# EAGLE design MYO_ESPControlBoard_Rev_1 (EAGLE 7.6.0)
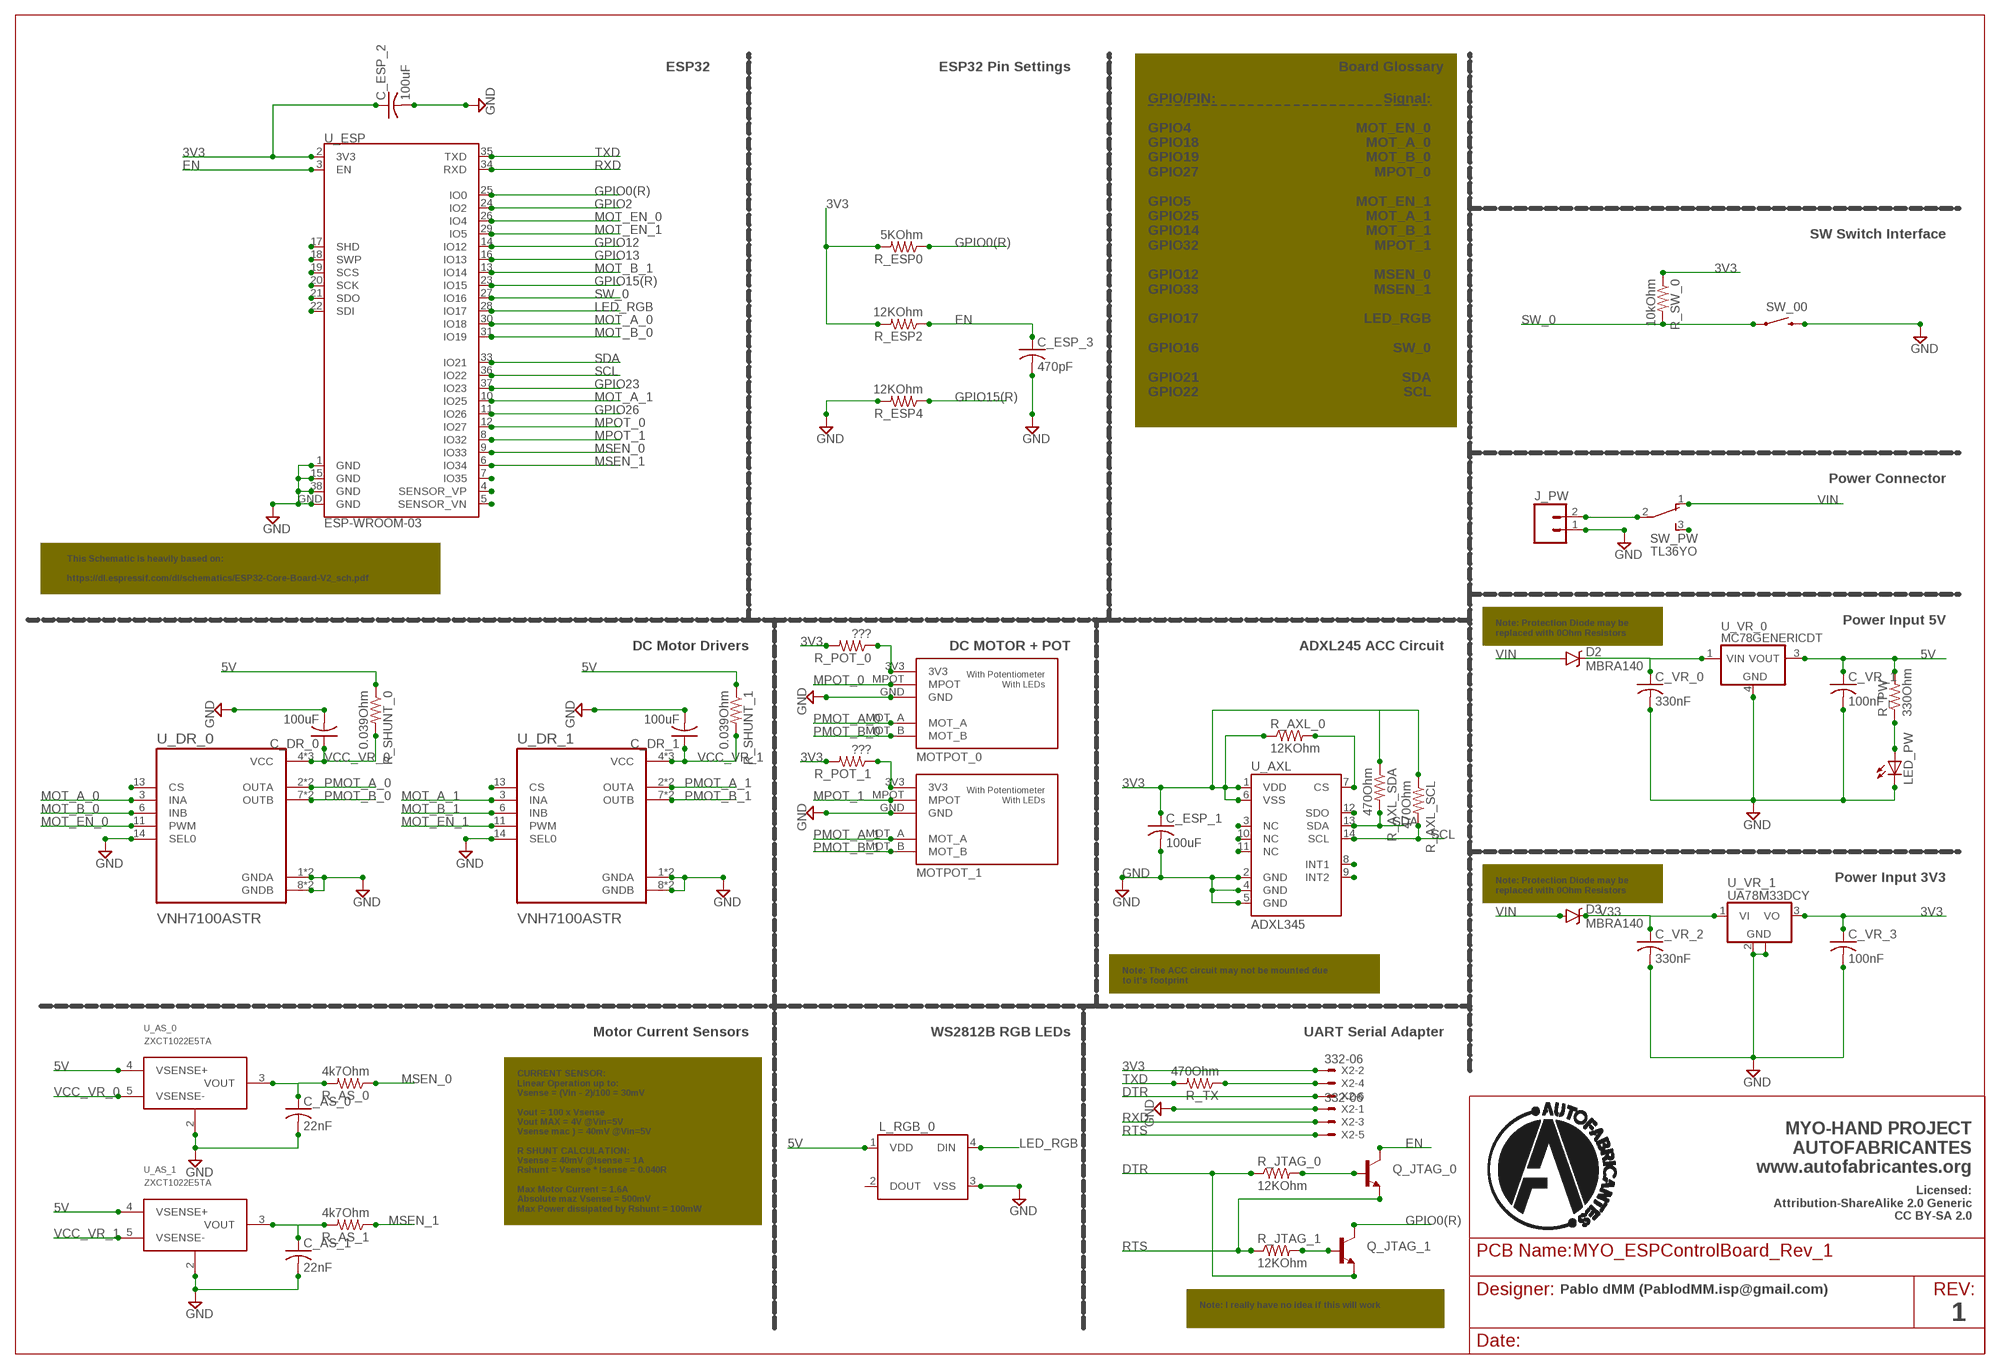
[diagram p0: schematic, sheet 1]

## Parts
C_AS_0  22nF  C-USC0805K  [C0805K]
C_AS_1  22nF  C-USC0805K  [C0805K]
C_DR_0  100uF  C-USC0805K  [C0805K]
C_DR_1  100uF  C-USC0805K  [C0805K]
C_ESP_1  100uF  C-USC0805K  [C0805K]
C_ESP_2  100uF  C-USC0805K  [C0805K]
C_ESP_3  470pF  C-USC0805K  [C0805K]
C_VR_0  330nF  C-USC0805  [C0805]
C_VR_1  100nF  C-USC0805  [C0805]
C_VR_2  330nF  C-USC0805  [C0805]
C_VR_3  100nF  C-USC0805  [C0805]
D2  MBRA140  [SMA-DIODE]
D3  MBRA140  [SMA-DIODE]
J_PW  M02-JST-2MM-SMT  [JST-2-SMD]
L_RGB_0  WS2812B  [WS2812B]
LED_PW  LEDSMT1206  [1206]
MOTPOT_0  POLOLU_MOT_POT  [POLOLU_MOT_POT]
MOTPOT_1  POLOLU_MOT_POT  [POLOLU_MOT_POT]
Q_JTAG_0  TRANSISTOR_NPNSOT23-3  [SOT23-3]
Q_JTAG_1  TRANSISTOR_NPNSOT23-3  [SOT23-3]
R_AS_0  4k7Ohm  R-US_M0805  [M0805]
R_AS_1  4k7Ohm  R-US_M0805  [M0805]
R_AXL_0  12KOhm  R-US_M0805  [M0805]
R_AXL_SCL  470Ohm  R-US_M0805  [M0805]
R_AXL_SDA  470Ohm  R-US_M0805  [M0805]
R_ESP0  5KOhm  R-US_M0805  [M0805]
R_ESP2  12KOhm  R-US_M0805  [M0805]
R_ESP4  12KOhm  R-US_M0805  [M0805]
R_JTAG_0  12KOhm  R-US_M0805  [M0805]
R_JTAG_1  12KOhm  R-US_M0805  [M0805]
R_POT_0  ???  R-US_M0805  [M0805]
R_POT_1  ???  R-US_M0805  [M0805]
R_PW  330Ohm  R-US_M0805  [M0805]
R_SHUNT_0  0.039Ohm  R-US_M0805  [M0805]
R_SHUNT_1  0.039Ohm  R-US_M0805  [M0805]
R_SW_0  10kOhm  R-US_M0805  [M0805]
R_TX  470Ohm  R-US_M0805  [M0805]
SW_00  SWITCH-MOMENTARY-2TACTILE-SWITCH-SMD-RIGHT-ANGLE  [TACTILE_SWITCH-SMD-RIGHT-ANGLE]
SW_PW  TL36YO  [TL3XYO]
U_AS_0  ZXCT1022E5TA  [SOT95P270X145-5N(SOT23-5)]
U_AS_1  ZXCT1022E5TA  [SOT95P270X145-5N(SOT23-5)]
U_AXL  ADXL345  [LGA14]
U_DR_0  VNH7100ASTR  [SOIC127P600X175-16N]
U_DR_1  VNH7100ASTR  [SOIC127P600X175-16N]
U_ESP  ESP-WROOM-03  [ESP-WROOM-03]
U_VR_0  MC78GENERICDT  [DPAK-3]
U_VR_1  UA78M33DCY  [SOT223]
X2  332-06  [332-06]

## Nets
3V3: C_ESP_1.1 C_ESP_2.1 C_VR_3.1 R_AXL_0.1 R_AXL_SCL.1 R_AXL_SDA.1 R_ESP0.2 R_ESP2.2 R_POT_0.2 R_POT_1.2 R_SW_0.1 U_AXL.1(VDD) U_AXL.6(VSS) U_ESP.2(3V3) U_VR_1.3(VO) X2.2
5V [GND]: C_VR_1.1 L_RGB_0.1(VDD) R_PW.2 R_SHUNT_0.1 R_SHUNT_1.1 U_AS_0.4(VSENSE+) U_AS_1.4(VSENSE+) U_VR_0.3(VOUT)
DTR: Q_JTAG_1.2(E) R_JTAG_0.1 X2.6
EN: C_ESP_3.1 Q_JTAG_0.3(C) R_ESP2.1 U_ESP.3(EN)
GND [GND]: C_AS_0.2 C_AS_1.2 C_DR_0.2 C_DR_1.2 C_ESP_1.2 C_ESP_2.2 C_ESP_3.2 C_VR_0.2 C_VR_1.2 C_VR_2.2 C_VR_3.2 J_PW.1 L_RGB_0.3(VSS) LED_PW.C MOTPOT_0.GND MOTPOT_1.GND R_ESP4.2 SW_00.2 U_AS_0.2(GND) U_AS_1.2(GND) U_AXL.2(GND) U_AXL.4(GND) U_AXL.5(GND) U_DR_0.1(GNDA) U_DR_0.8(GNDB) U_DR_0.9(GNDB) U_DR_0.14(SEL0) U_DR_0.16(GNDA) U_DR_1.1(GNDA) U_DR_1.8(GNDB) U_DR_1.9(GNDB) U_DR_1.14(SEL0) U_DR_1.16(GNDA) U_ESP.1(GND) U_ESP.15(GND) U_ESP.38(GND) U_ESP.GND U_VR_0.4(GND) U_VR_1.2(GND) U_VR_1.4(GND) X2.1
GPIO0(R): Q_JTAG_1.3(C) R_ESP0.1 U_ESP.25(IO0)
GPIO2: U_ESP.24(IO2)
GPIO12: U_ESP.14(IO12)
GPIO13: U_ESP.16(IO13)
GPIO15(R): R_ESP4.1 U_ESP.23(IO15)
GPIO23: U_ESP.37(IO23)
GPIO26: U_ESP.11(IO26)
LED_RGB: L_RGB_0.4(DIN) U_ESP.28(IO17)
MOT_A_0: U_DR_0.3(INA) U_ESP.30(IO18)
MOT_A_1: U_DR_1.3(INA) U_ESP.10(IO25)
MOT_B_0: U_DR_0.6(INB) U_ESP.31(IO19)
MOT_B_1: U_DR_1.6(INB) U_ESP.13(IO14)
MOT_EN_0: U_DR_0.11(PWM) U_ESP.26(IO4)
MOT_EN_1: U_DR_1.11(PWM) U_ESP.29(IO5)
MPOT_0: MOTPOT_0.MPOT U_ESP.12(IO27)
MPOT_1: MOTPOT_1.MPOT U_ESP.8(IO32)
MSEN_0: R_AS_0.1 U_ESP.9(IO33)
MSEN_1: R_AS_1.1 U_ESP.6(IO34)
N$1: U_DR_0.13(CS)
N$2: MOTPOT_0.3V3 R_POT_0.1
N$3: MOTPOT_1.3V3 R_POT_1.1
N$4: Q_JTAG_0.1(B) R_JTAG_0.2
N$5: LED_PW.A R_PW.1
N$6: U_DR_1.13(CS)
N$7: Q_JTAG_1.1(B) R_JTAG_1.2
N$9: R_TX.1 X2.4
N$11: C_AS_0.1 R_AS_0.2 U_AS_0.3(VOUT)
N$16: U_ESP.17(SHD)
N$17: U_AXL.11(NC)
N$20: U_ESP.18(SWP)
N$21: U_AXL.10(NC)
N$22: R_AXL_0.2 U_AXL.7(CS)
N$23: U_AXL.3(NC)
N$24: U_AXL.12(SDO)
N$25: U_AXL.8(INT1)
N$26: U_AXL.9(INT2)
N$27: U_ESP.19(SCS)
N$28: U_ESP.20(SCK)
N$29: U_ESP.21(SDO)
N$30: U_ESP.22(SDI)
N$31: J_PW.2 SW_PW.2(P)
N$33: U_ESP.7(IO35)
N$34: U_ESP.5(SENSOR_VN)
N$35: U_ESP.4(SENSOR_VP)
N$36: SW_PW.3(S)
N$42: C_AS_1.1 R_AS_1.2 U_AS_1.3(VOUT)
PMOT_A_0: MOTPOT_0.MOT_A U_DR_0.2(OUTA) U_DR_0.15(OUTA)
PMOT_A_1: MOTPOT_1.MOT_A U_DR_1.2(OUTA) U_DR_1.15(OUTA)
PMOT_B_0: MOTPOT_0.MOT_B U_DR_0.7(OUTB) U_DR_0.10(OUTB)
PMOT_B_1: MOTPOT_1.MOT_B U_DR_1.7(OUTB) U_DR_1.10(OUTB)
RTS: Q_JTAG_0.2(E) R_JTAG_1.1 X2.5
RXD: U_ESP.34(RXD) X2.3
SCL: R_AXL_SCL.2 U_AXL.14(SCL) U_ESP.36(IO22)
SDA: R_AXL_SDA.2 U_AXL.13(SDA) U_ESP.33(IO21)
SW_0: R_SW_0.2 SW_00.1 U_ESP.27(IO16)
TXD: R_TX.2 U_ESP.35(TXD)
V5: C_VR_0.1 D2.C U_VR_0.1(VIN)
V33: C_VR_2.1 D3.C U_VR_1.1(VI)
VCC_VR_0 [GND]: C_DR_0.1 R_SHUNT_0.2 U_AS_0.5(VSENSE-) U_DR_0.4(VCC) U_DR_0.5(VCC) U_DR_0.12(VCC)
VCC_VR_1 [GND]: C_DR_1.1 R_SHUNT_1.2 U_AS_1.5(VSENSE-) U_DR_1.4(VCC) U_DR_1.5(VCC) U_DR_1.12(VCC)
VIN: D2.A D3.A SW_PW.1(O)
Unconnected: L_RGB_0.2(DOUT)

## Notes on the sheet
- ESP32 | ESP32 Pin Settings | Board Glossary
- SW Switch Interface
- GPIO/PIN:
  
  GPIO4
  GPIO18
  GPIO19
  GPIO27
  
  GPIO5
  GPIO25
  GPIO14
  GPIO32
  
  GPIO12
  GPIO33
  
  GPIO17
  
  GPIO16
  
  GPIO21
  GPIO22
- Signal:
  
  MOT_EN_0
  MOT_A_0
  MOT_B_0
  MPOT_0
  
  MOT_EN_1
  MOT_A_1
  MOT_B_1
  MPOT_1
  
  MSEN_0
  MSEN_1
  
  LED_RGB
  
  SW_0
  
  SDA
  SCL
- Power Connector
- This Schematic is heavily based on:
  
  https://dl.espressif.com/dl/schematics/ESP32-Core-Board-V2_sch.pdf
- Note: Protection Diode may be
  replaced with 0Ohm Resistors
- Power Input 5V
- DC Motor Drivers | DC MOTOR + POT | ADXL245 ACC Circuit
- Note: Protection Diode may be
  replaced with 0Ohm Resistors
- Power Input 3V3
- Note: The ACC circuit may not be mounted due
  to it's footprint
- Motor Current Sensors | WS2812B RGB LEDs | UART Serial Adapter
- CURRENT SENSOR:
  Linear Operation up to:
  Vsense = (Vin - 2)/100 = 30mV
  
  Vout = 100 x Vsense
  Vout MAX = 4V @Vin=5V
  Vsense mac ) = 40mV @Vin=5V
  
  R SHUNT CALCULATION:
  Vsense = 40mV @Isense = 1A
  Rshunt = Vsense * Isense = 0.040R
  
  Max Motor Current = 1.6A
  Absolute maz Vsense = 500mV
  Max Power dissipated by Rshunt = 100mW
- MYO-HAND PROJECT
  AUTOFABRICANTES
  www.autofabricantes.org
- Licensed:
  Attribution-ShareAlike 2.0 Generic
  CC BY-SA 2.0
- Pablo dMM (PablodMM.isp@gmail.com)
- Note: I really have no idea if this will work | 1

## Library data of the parts
C_AS_0 C_AS_1 C_DR_0 C_DR_1 C_ESP_1-C_ESP_3 C_VR_0 C_VR_1-C_VR_3 = adafruit:C-US: CAPACITOR, American symbol
D2 D3 = SparkFun-DiscreteSemi:MBRA140: 40V, 1A Schottky rectifier SMA/DO-214AC package DIO-08053; PROD_ID: DIO-08053
J_PW = SparkFun:M02: Header 2 Standard 2-pin 0.1" header. Use with straight break away headers (SKU : PRT-00116), right angle break away headers (PRT-00553), swiss pins (PRT-00743), machine pins (PRT-00117), and female headers (PRT-00115). Molex polarized connector foot print use with SKU : PRT-08233 with associated crimp pins and housings.
L_RGB_0 = SparkFun-LED:WS2812B: WS2812B - Intelligent control LED integrated light source Technical Specifications: Power Supply Voltage (VDD): 3.5 to 5.3 V Input Voltage (VI): -0.5 to VDD+0.5 V Operating Junction Temperature (Topt): -25°C to +80°C Storage Temperature Range (Tstg): -55°C to +150°C; PROD_ID: DIO-12503
LED_PW = adafruit:LED: LED OSRAM: - CHIPLED LG R971, LG N971, LY N971, LG Q971, LY Q971, LO R971, LY R971 LH N974, LH R974 LS Q976, LO Q976, LY Q976 LO Q996 - Hyper CHIPLED LW Q18S LB Q993, LB Q99A, LB R99A - SideLED LS A670, LO A670, LY A670, LG A670, LP A670 LB A673, LV A673, LT A673, LW A673 LH A674 LY A675 LS A676, LA A676, LO A676, LY A676, LW A676 LS A679, LY A679, LG A679 - Hyper Micro SIDELED® LS Y876, LA Y876, LO Y876, LY Y876 LT Y87S - SmartLED LW L88C, LW L88S LB L89C, LB L89S, LG L890 LS L89K, LO L89K, LY L89K LS L896, LA L896, LO L896, LY L896 - TOPLED LS T670, LO T670, LY T670, LG T670, LP T670 LSG T670, LSP T670, LSY T670, LOP T670, LYG T670 LG T671, LOG T671, LSG T671 LB T673, LV T673, LT T673, LW T673 LH T674 LS T676, LA T676, LO T676, LY T676, LB T676, LH T676, LSB T676, LW T676 LB T67C, LV T67C, LT T67C, LS T67K, LO T67K, LY T67K, LW E67C LS E67B, LA E67B, LO E67B, LY E67B, LB E67C, LV E67C, LT E67C LW T67C LS T679, LY T679, LG T679 LS T770, LO T770, LY T770, LG T770, LP T770 LB T773, LV T773, LT T773, LW T773 LH T774 LS E675, LA E675, LY E675, LS T675 LS T776, LA T776, LO T776, LY T776, LB T776 LHGB T686 LT T68C, LB T68C - Hyper Mini TOPLED® LB M676 - Mini TOPLED Santana® LG M470 LS M47K, LO M47K, LY M47K Source: http://www.osram.convergy.de/
MOTPOT_0 MOTPOT_1 = PololuMotors:POLOLU_MOT_POT: Pololu Small Gearmotor with mechanical attach. With LEDs
Q_JTAG_0 Q_JTAG_1 = SparkFun:TRANSISTOR_NPN: Transistor NPN BJT configuration in SOT23 package. MMBT2222 is the common NPN we use. Double check BCE configuration again layout.
R_AS_0 R_AS_1 R_AXL_0 R_AXL_SCL R_AXL_SDA R_ESP0 R_ESP2 R_ESP4 R_JTAG_0 R_JTAG_1 R_POT_0 R_POT_1 R_PW R_SHUNT_0 R_SHUNT_1 R_SW_0 R_TX = adafruit:R-US_: RESISTOR, American symbol
SW_00 = SparkFun-Electromechanical:SWITCH-MOMENTARY-2: Various NO switches- pushbuttons, reed, etc; PROD_ID: COMP-12265
SW_PW = switch:TL36YO: TINY SWITCH ON - ON Source: http://www2.produktinfo.conrad.com/datenblaetter/700000-724999/705152-da-01-de-Subminiaturschalter_TL_36YO.pdf
U_AS_0 U_AS_1 = ZXCT1022E5TA:ZXCT1022E5TA: ZXCT1022 Series 300 kHz 25 uA 2.5 to 20 V High-Side Current Monitor - SOT-23-5; DESCRIPTION: Current Monitor Regulator High-Side SOT-23-5; DIGI-KEY_PART_NUMBER: ZXCT1022E5TACT-ND; MF: Diodes Inc.; MP: ZXCT1022E5TA; PACKAGE: SOT-23-5 Diodes Inc.; PURCHASE-URL: https://pricing.snapeda.com/search/part/ZXCT1022E5TA/?ref=eda
U_AXL = SparkFun:ADXL345
U_DR_0 U_DR_1 = VNH7100ASTR:VNH7100ASTR: None Check prices <https://pricing.snapeda.com/parts/VNH7100ASTR/STMicroelectronics/view-part?ref=eda>; AVAILABILITY: Bad; DESCRIPTION: Motor Driver Power MOSFET PWM 16-SOIC; MF: STMicroelectronics; MP: VNH7100ASTR; PACKAGE: SOIC-16 STMicroelectronics; PRICE: None
U_ESP = esp32:ESP-WROOM-03
U_VR_0 = _hhn_78xx_79xx_NCV78xx_d2pak_dpak:MC78*: 78xx SMD (D2PAK, DPAK) (MC)78xx..DT (DPAK-3; Rth,JA = 92 K/W) (MC)78xx..D2T (D2PAK-3; Rth,JA = 45 K/W @ 10x10mm copper area) Linear Voltage Regulators, Positive, 1 A (ON Semiconductor) Package dimenisions and soldering footprints acc. to ONSEMI specs. Source: http://onsemi.com Datasheet document#: MC7800/D Technologies: 78xxyD(2)Tz: xx = Output Voltage (V) y, z: additional suffixes see manufacturer's datasheet Author: Dipl.-Ing. FH Rainer Bayer HHN Hochschule Heilbronn, rainer.bayer@hs-heilbronn.de Ingenieurbüro ing-rb, mail@ing-rb.de
U_VR_1 = linear:UA78M*: POSITIVE-VOLTAGE REGULATORS Source: http://focus.ti.com/lit/ds/symlink/ua78m33.pdf
X2 = con-garry:332-06: 6 Pin - 2mm Dual Row Source: www.mpe-connector.de / garry_shortform_2012.pdf

## Net classes
1 GND: width 0.381 mm, clearance 0.305 mm
2 VCC: width 0.381 mm, clearance 0.305 mm to class 1

## Board
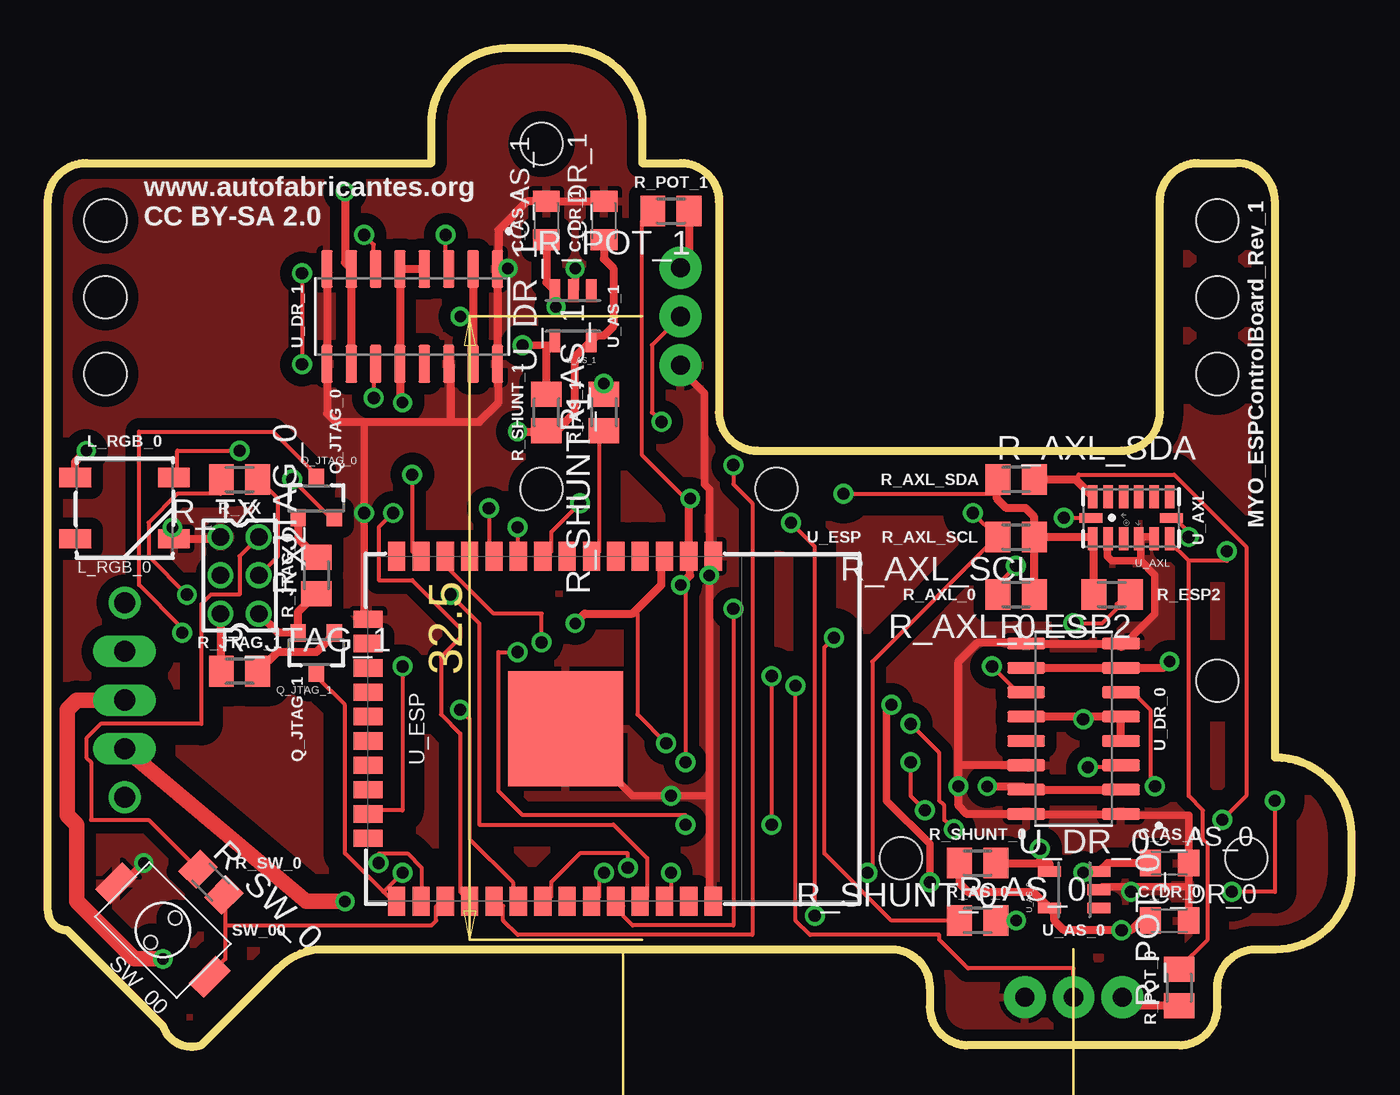
[diagram p1: board, top side]
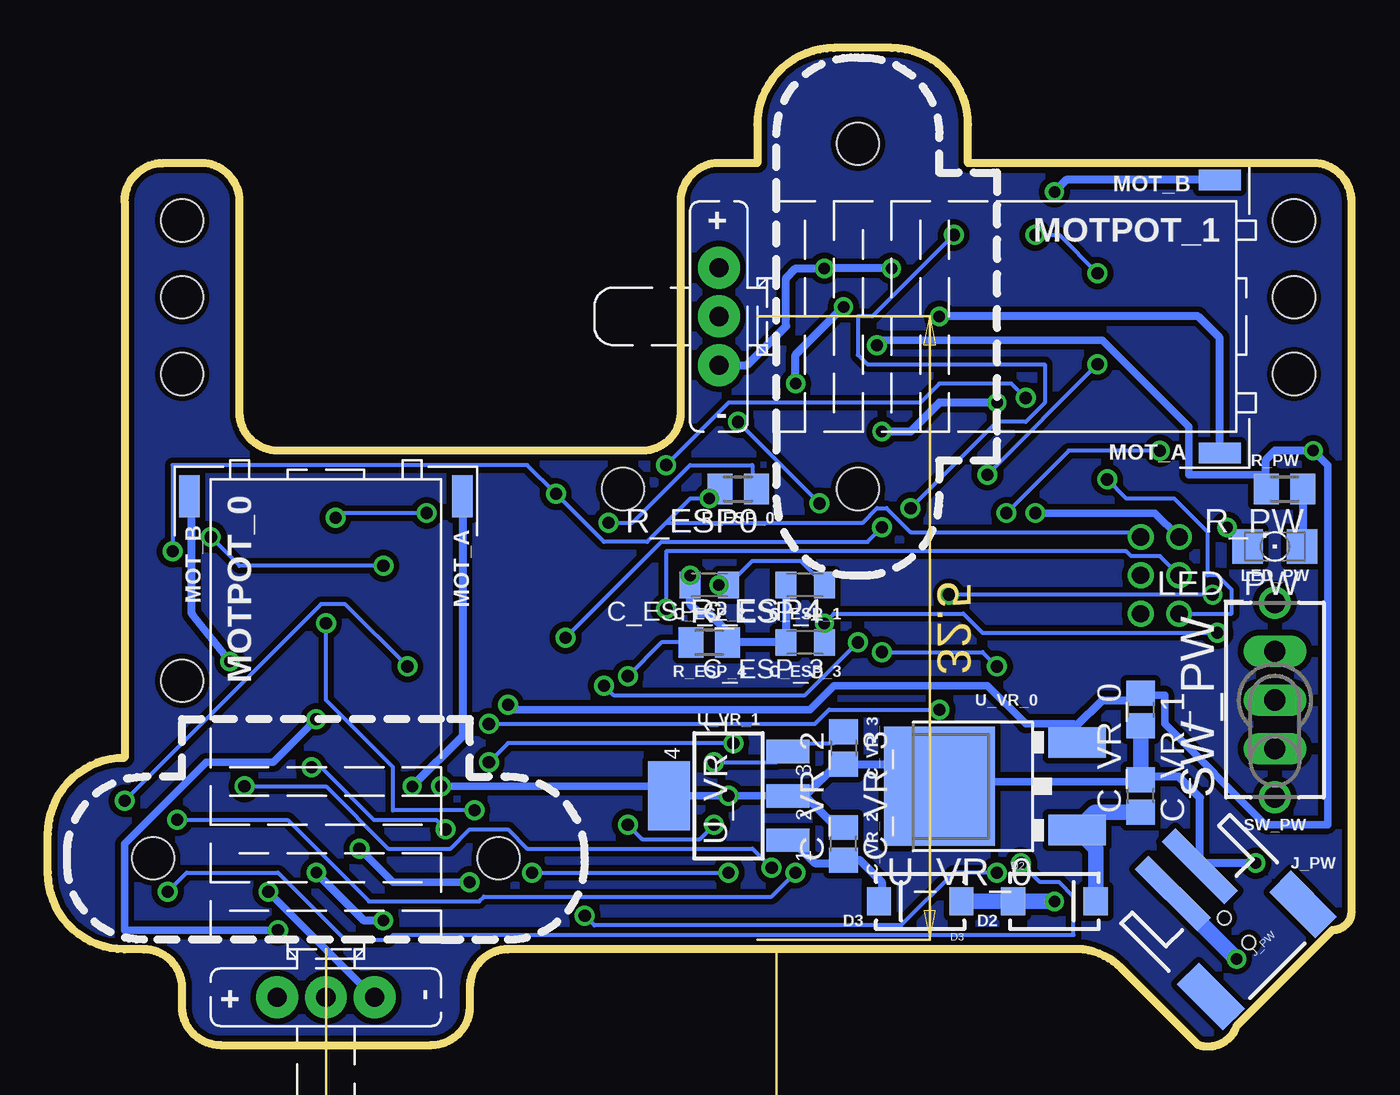
[diagram p2: board, bottom side, seen from below]

Size 68 x 52.08 mm. Coordinates in mm from the lower left corner, seen from the top.
Outline: 0,7.08 0,44.08 arc-90 2,46.08 20,46.08 20,48.08 arc-90 24,52.08 27,52.08 arc-90 31,48.08 31,46.08 33,46.08 arc-90 35,44.08 35,33.08 arc90 37,31.08 56,31.08 arc90 58,33.08 58,44.08 arc-90 60,46.08 62,46.08 arc-90 64,44.08 64,15.08 arc-90 68,11.08 68,9.08 arc-90 64,5.08 63,5.08 arc90 61,3.08 61,2.08 arc-90 59,0.08 48,0.08 arc-90 46,2.08 46,3.08 arc90 44,5.08 14,5.08 arc37 12,4.08 8,0.08 arc-90 6,1.08 1,6.08 arc-90 0,7.08
Copper layers (1*16): Top 0.035mm / dielectric 1.5mm / Bottom 0.035mm
Design rules "default *": minimum track width 8mil, minimum drill 25mil, track to track 8mil, track to pad 8mil, pad to pad 8mil, via to via 8mil, smd to smd 8mil, copper to edge 8mil, drill to drill 8mil, minimum pad ring 8mil, minimum via ring 8mil, stop-mask expansion 4mil, vias tented up to drill 0mil, thermal gap 10mil
Holes 2.2 mm at 3,43.08 61,43.08 61,35.08 61,39.08 3,39.08 3,35.08 61,19.08 38,29.08
Milling: area 21.7,5.6 to 22.3,7.1; area 21.7,36.6 to 22.3,38.1; area 19.8,19.1 to 21.6,24.6; area 52,-3.2 to 53.5,-2.6; area 30,-3.2 to 31.5,-2.6; area 39,-5.1 to 44.5,-3.3; 6 lines

### Footprints (pad centres in the part's own frame; a part is rotated, then mirrored left to right if it is on the bottom)
C0805K = smd 1.1 x 1.4: 1 -1,0; 2 1,0
C0805 = smd 1.3 x 1.5: 1 -0.85,0; 2 0.85,0
SMA-DIODE = smd 1.27 x 1.47: A -2.15,0; C 2.15,0
JST-2-SMD = smd 1 x 4.6: 1 -1,-3.7; 2 1,-3.7 | smd 1.6 x 3.4: NC1 -3.4,1.5; NC2 3.4,1.5
WS2812B = smd 1.651 x 1: 1 -2.577,1.6; 2 -2.577,-1.6; 3 2.577,-1.6; 4 2.577,1.6
1206 = smd 1.6 x 1.803: A -1.422,0; C 1.422,0
POLOLU_MOT_POT = drill 1 pad 2.184: 3V3 2.54,3; GND -2.54,3; MPOT 0,3 | smd 1.067 x 2.184: MOT_A -7.12,-23.12; MOT_B 7.12,-23.12 | hole 2.2: -9,-4.25; 9,-4.25
SOT23-3 = smd 0.8 x 0.9: 1 -0.95,-1; 2 0.95,-1; 3 0,1.1
M0805 = smd 1.3 x 1.6: 1 -0.95,0; 2 0.95,0
TACTILE_SWITCH-SMD-RIGHT-ANGLE = smd 1.1 x 2: 1 -3.45,0; 2 3.45,0 | hole 0.7: 0,0.9; 0,-0.9
TL3XYO = drill 1.1 pad 1.422 long: 1 -2.54,0; 2 0,0; 3 2.54,0 | drill 1.1 pad 1.676: M1 -5.08,0; M2 5.08,0
SOT95P270X145-5N(SOT23-5) = smd 0.55 x 1.2: 1 -0.844,-1.331; 2 0.106,-1.331; 3 1.056,-1.331; 4 1.056,1.269; 5 -0.844,1.269
LGA14 = smd 0.5 x 1.2: 1 2,1.1; 2 1.2,1.1; 3 0.4,1.1; 4 -0.4,1.1; 5 -1.2,1.1; 6 -2,1.1; 8 -2,-1.1; 9 -1.2,-1.1; 10 -0.4,-1.1; 11 0.4,-1.1; 12 1.2,-1.1; 13 2,-1.1 | smd 1.2 x 0.5: 7 -2.1,0; 14 2.1,0
SOIC127P600X175-16N = smd 1.97 x 0.6: 1 -2.475,4.445; 2 -2.475,3.175; 3 -2.475,1.905; 4 -2.475,0.635; 5 -2.475,-0.635; 6 -2.475,-1.905; 7 -2.475,-3.175; 8 -2.475,-4.445; 9 2.475,-4.445; 10 2.475,-3.175; 11 2.475,-1.905; 12 2.475,-0.635; 13 2.475,0.635; 14 2.475,1.905; 15 2.475,3.175; 16 2.475,4.445
ESP-WROOM-03 = smd 0.9 x 1.5: 1 7.7,9; 2 6.43,9; 3 5.16,9; 4 3.89,9; 5 2.62,9; 6 1.35,9; 7 0.08,9; 8 -1.19,9; 9 -2.46,9; 10 -3.73,9; 11 -5,9; 12 -6.27,9; 13 -7.54,9; 14 -8.81,9; 25 -8.81,-9; 26 -7.54,-9; 27 -6.27,-9; 28 -5,-9; 29 -3.73,-9; 30 -2.46,-9; 31 -1.19,-9; 32 0.08,-9; 33 1.35,-9; 34 2.62,-9; 35 3.89,-9; 36 5.16,-9; 37 6.43,-9; 38 7.7,-9 | smd 1.5 x 0.9: 15 -10.3,5.715; 16 -10.3,4.445; 17 -10.3,3.175; 18 -10.3,1.905; 19 -10.3,0.635; 20 -10.3,-0.635; 21 -10.3,-1.905; 22 -10.3,-3.175; 23 -10.3,-4.445; 24 -10.3,-5.715 | smd 6 x 6: GND 0,0
DPAK-3 = smd 1.6 x 3: 1 -2.286,-7.18; 3 2.286,-7.18 | smd 6.2 x 5.8: 4 0,0
SOT223 = smd 1.219 x 2.235: 1 -2.311,-3.099; 2 0,-3.099; 3 2.311,-3.099 | smd 3.6 x 2.2: 4 0,3.099
332-06 = drill 0.9 pad 1.27: 1 -2,-1; 2 -2,1; 3 0,-1; 4 0,1; 5 2,-1; 6 2,1

### Placement (x,y rotation side)
C_AS_0  58.5,9.58 0 top
C_AS_1  26,43.08 90 top
C_DR_0  58.5,6.58 0 top
C_DR_1  29,43.08 90 top
C_ESP_1  28.5,24.08 180 bottom
C_ESP_2  33.5,24.08 180 bottom
C_ESP_3  28.5,21.08 180 bottom
C_VR_0  11,13.08 90 bottom
C_VR_1  11,17.58 270 bottom
C_VR_2  26.5,10.58 90 bottom
C_VR_3  26.5,15.58 270 bottom
D2  15.5,7.58 0 bottom
D3  22.5,7.58 180 bottom
J_PW  6,6.08 225 bottom
L_RGB_0  4,28.08 0 top
LED_PW  4,26.08 180 bottom
MOTPOT_0  53.5,5.58 180 bottom
MOTPOT_1  30,38.08 90 bottom
Q_JTAG_0  14,28.58 0 top
Q_JTAG_1  14,20.58 180 top
R_AS_0  48.5,6.58 0 top
R_AS_1  29,33.08 90 top
R_AXL_0  50.5,23.58 180 top
R_AXL_SCL  50.5,26.58 180 top
R_AXL_SDA  50.5,29.58 0 top
R_ESP0  32,29.08 180 bottom
R_ESP2  55.5,23.58 180 top
R_ESP4  33.5,21.08 0 bottom
R_JTAG_0  14,24.58 90 top
R_JTAG_1  10,19.58 0 top
R_POT_0  59,3.08 90 top
R_POT_1  32.5,43.58 180 top
R_PW  3.5,29.08 180 bottom
R_SHUNT_0  48.5,9.58 180 top
R_SHUNT_1  26,33.08 270 top
R_SW_0  8.5,8.58 315 top
R_TX  10,29.58 180 top
SW_00  6,6.08 135 top
SW_PW  4,18.08 90 bottom
U_AS_0  53.5,8.08 90 top
U_AS_1  27.5,38.08 180 top
U_AXL  56.5,27.58 180 top
U_DR_0  53.5,16.58 180 top
U_DR_1  19,38.08 270 top
U_ESP  27,16.58 0 top
U_VR_0  21.5,13.58 90 bottom
U_VR_1  32.5,13.08 90 bottom
X2  10,24.58 270 top

### Tracks (layer width: path | path; a pad name or v marks a point on that pad's centre or on a via)
3V3  (via drill 0.6, 0.64)
  Top 0.203: X2.2 10,25.58 10,23.58 8.5,23.58 8,23.08 8,16.83 2.75,16.83 2,16.08 2,15.08 2.25,14.83 2.25,11.83 5.25,11.83 7.75,9.33 R_SW_0.1 | 59.5,25.33 58.5,26.33 U_AXL.6 | 59.5,25.33 59.5,13.08 60.25,12.33 60.25,10.83 60.5,10.58 60.5,5.58 59,4.08 R_POT_0.2 | R_POT_1.2 31.5,43.58 31,43.08 31,30.83 33.25,28.58 v33.5,28.58 | v33.25,14.83 33.25,24.08 v33,24.08 | v41.5,28.83 49.5,28.83 R_AXL_SDA.1 | 59.5,25.33 61.5,25.33 v61.5,25.83
  Top 0.406: R_ESP2.2 54.55,26.43 U_AXL.1 54.4,26.58 R_AXL_SCL.1 | R_AXL_0.1 R_AXL_SCL.1 | R_AXL_SCL.1 51.45,27.63 51,28.08 50,28.08 49.5,28.58 49.5,28.83 49.5,29.53 R_AXL_SDA.1 | v33,24.08 33.5,24.58 33.5,25.51 U_ESP.2 33.43,28.51 v33.5,28.58
  Bottom 0.203: C_VR_3.1 26.5,16.33 27,15.83 29,15.83 29.25,15.58 U_VR_1.3 29.5,15.33 30,14.83 v33.25,14.83 | C_ESP_1.1 28.75,25.33 31.25,25.33 C_ESP_2.1 | 35.75,27.33 34.5,28.58 v33.5,28.58 R_ESP0.2 | 35.75,27.33 36.75,26.33 39,26.33 v41.5,28.83 43,30.33 61.5,30.33 v61.5,25.83 | X2.2 11.25,26.83 23,26.83 24.25,28.08 24.75,28.08 25.5,27.33 35.75,27.33
  Bottom 0.406: C_ESP_2.1 v33,24.08 | v33.5,28.58 33.45,28.58 R_ESP0.2
5V  (via drill 0.6, 0.64)
  Top 0.381: v24.75,36.58 26,36.58 26.11,36.47 | v51.75,10.33 51.75,9.58 | v46,8.58 46,10.58 43.75,12.83 43.75,17.58 v44,17.83
  Top 0.406: R_SHUNT_0.1 51.75,9.58 52.23,9.58 U_AS_0.4 | R_SHUNT_1.1 26,36.37 26.11,36.47 U_AS_1.4 | L_RGB_0.1 1.42,30.5 v2,31.08
  Bottom 0.381: v24.75,36.58 24.5,36.83 13,36.83 8.5,32.33 8.5,29.83 4.5,29.83 R_PW.2 | v51.75,10.33 50,8.58 v46,8.58 | v44,17.83 43.75,17.58 28.25,17.58 27,18.83 19,18.83 17,16.83 14.5,16.83 14.32,16.76 | v2,31.08 1.25,30.33 1.25,11.58 4.5,11.58 9.75,16.83 9.75,18.33 11,18.33 C_VR_1.1
  Bottom 0.406: v2,31.08 4,31.08 4.5,30.58 4.5,29.83 4.5,29.13 R_PW.2 | U_VR_0.3 14.32,16.76 13,18.08 11.35,18.08 C_VR_1.1
DTR
  Top 0.406: R_JTAG_0.1 13.05,22.68 Q_JTAG_1.2 12,21.58 X2.6
EN  (via drill 0.6, 0.64)
  Top 0.203: v7,21.58 7,21.83 4.75,24.08 4.75,32.08 11.75,32.08 14,29.83 Q_JTAG_0.3 | v53.5,22.08 55,22.08 55.75,22.83 55.75,23.08 56.25,23.58 R_ESP2.1 | v45.75,12.33 45,13.08 v45,14.83 | v32.25,15.83 30.75,17.33 30.75,22.58 30.62,22.7
  Top 0.406: v27.5,22.08 28,22.58 30.5,22.58 30.62,22.7 32,24.08 32,25.42 U_ESP.3
  Bottom 0.203: v7,21.58 19.25,21.58 20.25,22.58 27,22.58 v27.5,22.08 | v53.5,22.08 53.5,18.08 50,14.58 50,12.33 v45.75,12.33 | v45,14.83 44,15.83 v32.25,15.83
  Bottom 0.406: C_ESP_3.1 v27.5,22.08
GBD
  pour Bottom (isolate 0.305): 0,7.08 arc90 1,6.08 6,1.08 7,0.08 arc90 8,0.08 12,4.08 arc-37 14,5.08 44,5.08 arc-90 46,3.08 46,2.08 arc90 48,0.08 59,0.08 arc90 61,2.08 61,3.08 arc-90 63,5.08 64,5.08 arc90 68,9.08 68,11.08 arc90 64,15.08 64,44.08 arc90 62,46.08 60,46.08 arc90 58,44.08 58,33.08 arc-90 56,31.08 37,31.08 arc-90 35,33.08 35,44.08 arc90 33,46.08 31,46.08 31,48.08 arc90 27,52.08 24,52.08 arc90 20,48.08 20,46.08 3,46.08 2,46.08 arc90 0,44.08
GND  (via drill 0.6, 0.64)
  Top 0.381: 57,25.33 55.5,25.33 55.25,25.58 55.25,26.33 U_AXL.2 | 57,25.33 57,26.33 U_AXL.4 57,26.58 57.5,26.58 U_AXL.5 | 57,25.33 57.75,24.58 57.75,22.58 56,20.83 U_DR_0.8 | 59.5,8.33 56.5,8.33 | 56.5,8.33 55,8.33 U_AS_0.2 | 59.5,8.33 C_AS_0.2 59.5,12.08 56,12.08 U_DR_0.1 | 59.5,8.33 C_DR_0.2 | 56.5,8.33 v56.5,8.08 | 16.5,32.58 v16.5,27.83 16.5,22.33 U_ESP.15 | v34.5,24.58 34.5,13.08 | 34.5,13.08 34.5,7.58 U_ESP.38 | U_ESP.GND 30.5,13.08 v32.5,13.08 34.5,13.08 | MOTPOT_1.GND 33,35.33 34.25,34.08 34.25,29.33 34.5,29.08 34.5,25.58 U_ESP.1
  Top 0.406: U_DR_0.1 U_DR_0.16 47.95,12.13 47.5,12.58 v47.5,13.58 47.5,14.58 | U_DR_0.8 U_DR_0.9 50.97,21.08 48.5,21.08 47.5,20.08 47.5,14.58 | U_DR_1.8 U_DR_1.9 14.55,33.02 15,32.58 16.5,32.58 21,32.58 | U_DR_1.1 U_DR_1.16 23.5,35.55 23.5,33.58 22.5,32.58 21,32.58 | U_DR_1.1 23.5,40.61 23.5,42.58 25,44.08 C_AS_1.2 C_DR_1.2 | U_DR_1.1 23.98,40.55 v24,40.58 | v27.5,40.58 27.5,39.52 U_AS_1.2 | X2.1 8.9,26.48 L_RGB_0.3 6.58,27 v6.5,27.08 | v34.5,24.58 34.5,25.38 U_ESP.1 | SW_00.2 3.94,8.52 v5,9.58 | U_DR_1.14 20.98,35.6 21,35.58 21,32.58 | U_DR_0.14 47.59,14.67 47.5,14.58
  Bottom 0.381: v56.5,8.08 51,2.58 MOTPOT_0.GND | U_VR_1.2 v32.5,13.08 U_VR_1.4 35.75,13.08 36.25,13.58 v47.5,13.58 | U_VR_0.4 21.5,13.83 11.25,13.83 C_VR_0.2 | X2.1 10.25,27.83 v16.5,27.83
  Bottom 0.406: v24,40.58 v27.5,40.58 29,40.58 29.5,40.08 29.5,37.58 31.54,35.54 MOTPOT_1.GND | v6.5,27.08 6.42,27.08 LED_PW.C | v34.5,24.58 C_ESP_2.2 34.5,23.08 34,22.58 33.5,22.58 32.55,21.63 R_ESP4.2 C_ESP_3.2 C_ESP_1.2 | C_VR_2.2 26.85,11.43 28.5,13.08 | 28.5,13.08 U_VR_1.2 | 28.5,13.08 26.85,14.73 C_VR_3.2 22.65,14.73 U_VR_0.4 | v5,9.58 7.73,9.58 J_PW.1 7.91,12.99 9,14.08 10.85,14.08 C_VR_0.2
  Bottom 0.813: C_VR_0.2 C_VR_1.2
  pour Top (isolate 0.61): 0,7.08 0,44.08 arc-90 2,46.08 20,46.08 20,48.08 arc-90 24,52.08 27,52.08 arc-90 31,48.08 31,46.08 33,46.08 arc-90 35,44.08 35,33.08 arc90 37,31.08 56,31.08 arc90 58,33.08 58,44.08 arc-90 60,46.08 62,46.08 arc-90 64,44.08 64,15.08 arc-90 68,11.08 68,9.08 arc-90 64,5.08 63,5.08 arc90 61,3.08 61,2.08 arc-90 59,0.08 48,0.08 arc-90 46,2.08 46,3.08 arc90 44,5.08 14,5.08 arc67 11,3.08 8,0.08 7,0.08 arc-90 6,1.08 1,6.08 arc-90
GPIO0(R)  (via drill 0.64)
  Top 0.203: 17.5,8.08 18,7.58 U_ESP.25 | 17.5,8.08 15.5,10.08 15.5,17.83 14,19.33 Q_JTAG_1.3 | v38.75,27.33 40,26.08 v40,6.83 | 17.5,8.08 v18.5,9.08
  Bottom 0.203: v38.75,27.33 37.5,27.33 34.5,30.33 31.25,30.33 31.25,29.08 R_ESP0.1 | v40,6.83 39.5,6.33 23.5,6.33 20.75,9.08 v18.5,9.08
GPIO15(R)  (via drill 0.64)
  Top 0.203: v18.5,19.83 18.5,12.33 16.75,12.33 U_ESP.23 | v24.5,20.58 23.5,20.58 23.5,13.33 24.75,12.08 33.25,12.08 v33.25,11.58 | v37.75,19.33 v37.75,11.58
  Bottom 0.203: v18.5,19.83 19.25,20.58 v24.5,20.58 | v33.25,11.58 34,10.83 37,10.83 v37.75,11.58 | v37.75,19.33 36,21.08 R_ESP4.1
LED_RGB  (via drill 0.64)
  Top 0.203: U_ESP.28 21.5,8.08 21.5,16.33 20.5,17.33 20.5,20.33 21.5,21.33 21.5,21.83 19,24.33 17.25,24.33 17.25,27.08 v18,27.83 | v10,31.08 6.75,31.08 6.75,29.83 L_RGB_0.4
  Bottom 0.203: v18,27.83 14.75,31.08 v10,31.08
MOT_A_0  (via drill 0.64)
  Top 0.203: v21.5,17.58 22,17.08 22,10.83 24.25,8.58 24.25,7.83 24.5,7.58 U_ESP.30 | v45,16.83 46.5,15.33 46.5,12.83 46.75,12.58 46.75,11.83 v47.25,11.33 | v54.25,14.58 55.75,14.58 U_DR_0.3
  Bottom 0.203: v21.5,17.58 27.25,17.58 28,16.83 v45,16.83 | v47.25,11.33 47.75,11.83 51,11.83 53.75,14.58 v54.25,14.58
MOT_A_1  (via drill 0.64)
  Top 0.203: v23,28.08 23,25.83 23.25,25.58 U_ESP.10 | v20.75,42.33 20.75,40.58 U_DR_1.3
  Bottom 0.203: v23,28.08 18.5,32.58 17,32.58 16,33.58 16,35.58 25.25,35.58 25.75,36.08 25.75,38.08 25,38.08 v20.75,42.33
MOT_B_0  (via drill 0.64)
  Top 0.203: v30.25,9.33 30.25,10.08 27.75,10.08 26.25,8.58 26.25,7.83 26,7.58 U_ESP.31 | v57.75,13.58 57.5,13.83 57.5,17.58 56.75,18.33 56,18.33 U_DR_0.6
  Bottom 0.203: v30.25,9.33 31.25,10.33 43,10.33 44,11.33 46,11.33 47,10.33 50.25,10.33 53.5,13.58 v57.75,13.58
MOT_B_1  (via drill 0.64)
  Top 0.203: v19,29.83 19,25.83 19.25,25.58 U_ESP.13 | v13.25,40.33 v13.25,35.58 | v16.5,42.33 17,41.83 17,40.58 U_DR_1.6
  Bottom 0.203: v13.25,35.58 v19,29.83 | v13.25,40.33 15.25,42.33 v16.5,42.33
MOT_EN_0  (via drill 0.64)
  Top 0.203: v17.25,9.58 17.25,10.08 18.75,10.08 19.5,9.33 19.5,7.58 U_ESP.26 | v61.75,8.08 64,8.08 v64,12.83 | v49.25,19.83 50.5,18.58 51,18.58 U_DR_0.11
  Bottom 0.203: v17.25,9.58 16.25,8.58 15.25,8.58 14.5,7.83 14.5,5.83 50,5.83 50.25,5.58 52.5,5.58 56,9.08 60.75,9.08 v61.75,8.08 | v64,12.83 53.75,23.08 52.5,23.08 v49.25,19.83
MOT_EN_1  (via drill 0.64)
  Top 0.203: v35.75,30.33 35.75,29.33 36.75,28.33 36.75,5.83 24.5,5.83 23.75,6.58 23.75,7.33 23.5,7.58 U_ESP.29 | v17,33.83 17,35.58 U_DR_1.11
  Bottom 0.203: v35.75,30.33 32.5,33.58 22.5,33.58 21.5,34.58 17.75,34.58 v17,33.83
MPOT_0  (via drill 0.64)
  Top 0.203: v25.75,21.08 25.75,22.58 23.25,22.58 21,24.83 21,25.33 20.75,25.58 U_ESP.12 | v39,18.83 39,6.58 39.75,5.83 46.5,5.83 46.5,5.58 48,4.08 53.5,4.08 MOTPOT_0.MPOT
  Bottom 0.203: v25.75,21.08 28.5,18.33 38.5,18.33 v39,18.83
MPOT_1  (via drill 0.64)
  Top 0.203: v27.75,28.33 26.25,26.83 26.25,25.83 26,25.58 U_ESP.8 | v32,32.58 31.5,33.08 31.5,36.58 MOTPOT_1.MPOT
  Bottom 0.203: v32,32.58 v27.75,28.33
MSEN_0  (via drill 0.64)
  Top 0.203: v24.5,27.08 24.5,25.58 U_ESP.9 | v41,21.33 40.5,20.83 40.5,10.08 44,6.58 R_AS_0.1
  Bottom 0.203: v24.5,27.08 25.25,26.33 36,26.33 v41,21.33
MSEN_1
  Top 0.203: U_ESP.6 28.5,25.58 28.75,25.83 28.75,31.83 29,32.08 R_AS_1.1
N$2
  Top 0.406: R_POT_0.1 56.49,2.13 MOTPOT_0.3V3
N$3
  Top 0.406: R_POT_1.1 33.45,41.07 MOTPOT_1.3V3
N$4
  Top 0.406: Q_JTAG_0.1 13.05,26.48 R_JTAG_0.2
N$5
  Bottom 0.406: R_PW.1 2.55,26.11 LED_PW.A
N$7
  Top 0.406: Q_JTAG_1.1 14.95,21.53 14,20.58 11.95,20.58 R_JTAG_1.2
N$8
  pour Top (isolate 1.016): 0,7.08 0,44.08 arc-90 2,46.08 20,46.08 20,48.08 arc-90 24,52.08 27,52.08 arc-90 31,48.08 31,46.08 33,46.08 arc-90 35,44.08 35,33.08 arc90 37,31.08 56,31.08 arc90 58,33.08 58,44.08 arc-90 60,46.08 62,46.08 arc-90 64,44.08 64,15.08 arc-90 68,11.08 68,9.08 arc-90 64,5.08 63,5.08 arc90 61,3.08 61,2.08 arc-90 59,0.08 48,0.08 arc-90 46,2.08 46,3.08 arc90 44,5.08 14,5.08 arc53 12,4.08 8,0.08 7,0.08 arc-90 6,1.08 1,6.08 arc-90
N$9
  Top 0.203: X2.4 12,25.58 12,28.58 11,29.58 R_TX.1
N$11  (via drill 0.6)
  Top 0.406: C_AS_0.1 55.27,9.58 U_AS_0.3 54.77,9.08 v54,9.08 | R_AS_0.2 v50.5,6.58
  Bottom 0.406: v50.5,6.58 51.5,6.58 v54,9.08
N$22  (via drill 0.64)
  Top 0.203: v59.5,26.58 59.5,26.83 58.75,27.58 U_AXL.7 | v50.5,25.08 49.75,24.33 49.75,23.58 R_AXL_0.2
  Bottom 0.203: v59.5,26.58 58,25.08 v50.5,25.08
N$31  (via drill 0.6)
  Top 0.813: v6,4.58 4.5,4.58 1.5,7.58 1.5,11.58 1,12.08 1,17.58 1.5,18.08 SW_PW.2
  Bottom 0.813: J_PW.2 9.32,7.9 v6,4.58
N$42  (via drill 0.6)
  Top 0.406: C_AS_1.1 26,39.85 U_AS_1.3 26.5,39.35 v26.5,38.58 | R_AS_1.2 v29,34.58
  Bottom 0.406: v29,34.58 29,36.08 v26.5,38.58
PMOT_A_0  (via drill 0.6)
  Top 0.406: U_DR_0.2 U_DR_0.15 50.85,13.58 v49,13.58
  Bottom 0.406: MOTPOT_0.MOT_A 46.38,16.2 v49,13.58
PMOT_A_1  (via drill 0.6)
  Top 0.406: U_DR_1.2 22.18,38.08 | 22.18,38.08 U_DR_1.15 | v21.5,38.08 22.18,38.08
  Bottom 0.406: MOTPOT_1.MOT_A 6.88,36.96 8,38.08 v21.5,38.08
PMOT_B_0  (via drill 0.6)
  Top 0.406: U_DR_0.10 U_DR_0.7 58.17,19.75 v58.5,20.08
  Bottom 0.406: v58.5,20.08 60.5,22.58 60.5,28.58 MOTPOT_0.MOT_B
PMOT_B_1  (via drill 0.6)
  Top 0.406: U_DR_1.10 U_DR_1.7 15.5,40.88 v15.5,44.58
  Bottom 0.406: MOTPOT_1.MOT_B 14.88,45.2 v15.5,44.58
RTS  (via drill 0.64)
  Top 0.203: v12.75,29.58 14.75,27.58 Q_JTAG_0.2
  Top 0.406: X2.5 9,19.63 R_JTAG_1.1
  Bottom 0.203: v12.75,29.58 11.75,28.58 9.25,28.58 7.5,26.83 7.5,24.58 7,24.58 6.25,23.83 6.25,22.58 X2.5
RXD  (via drill 0.64)
  Top 0.203: v35.75,22.83 35.75,6.33 30.5,6.33 30,6.83 30,7.33 29.75,7.58 U_ESP.34
  Bottom 0.203: v35.75,22.83 35.75,25.83 11.75,25.83 11.5,25.58 10,25.58 X2.3
SCL  (via drill 0.64)
  Top 0.203: v53,27.58 U_AXL.14 | 49.5,26.58 v48.25,27.83 | v32.5,9.08 32.5,7.83 32.25,7.58 U_ESP.36 | v42.75,9.08 43,9.33 43,20.08 49.5,26.58 | 49.5,26.58 R_AXL_SCL.2
  Bottom 0.203: v53,27.58 52.75,27.83 v48.25,27.83 | v42.75,9.08 v32.5,9.08
SDA  (via drill 0.64)
  Top 0.203: v29,9.08 28.75,8.83 28.75,7.83 28.5,7.58 U_ESP.33 | v61.25,11.83 62.5,13.08 62.5,26.08 58.75,29.83 53.75,29.83 53.75,29.58 53.6,29.58
  Top 0.406: R_AXL_SDA.2 53.6,29.58 U_AXL.13
  Bottom 0.203: v29,9.08 30.25,7.83 45.25,7.83 45.5,7.58 51.25,7.58 55.5,11.83 v61.25,11.83
SW_0
  Top 0.203: 9.25,6.33 20,6.33 20.25,6.58 20.25,7.33 20.5,7.58 U_ESP.27 | 9.25,6.33 9.25,7.83 R_SW_0.2 | 9.25,6.33 9.25,4.58 8.5,3.83 SW_00.1
TXD  (via drill 0.64)
  Top 0.203: v21,23.58 22.5,22.08 22.5,11.58 29.5,11.58 31.25,9.83 31.25,7.83 31,7.58 U_ESP.35 | v7.25,23.58 5.25,25.58 5.25,27.33 6.75,28.83 9,28.83 9,29.58 R_TX.2
  Bottom 0.203: v7.25,23.58 v21,23.58
V5
  Bottom 0.813: C_VR_0.1 13.38,12.23 U_VR_0.1 13.35,10.32 D2.C
V33
  Bottom 0.406: U_VR_1.1 29.19,10.77 28,9.58 26.65,9.58 C_VR_2.1 25.65,9.73 24.5,8.58 24.5,7.73 D3.C
VCC_VR_0  (via drill 0.64)
  Top 0.381: v54,17.08 54,17.21
  Top 0.406: U_DR_0.12 54,17.21 U_DR_0.5 55.98,16.08 56,16.08 56,15.94 U_DR_0.4 | C_DR_0.1 57,6.58 56.5,6.08 v56,6.08 53,6.08 52.5,6.58 52.5,6.97 U_AS_0.5 51.39,8.08 48,8.08 47.55,8.53 R_SHUNT_0.2
  Bottom 0.381: v54,17.08 56.25,14.83 59.75,14.83 64,10.58 64,6.08 v56,6.08
VCC_VR_1  (via drill 0.6)
  Top 0.406: U_DR_1.4 U_DR_1.5 U_DR_1.12 18.36,33.71 v18.5,33.58 | C_DR_1.1 29,41.08 29.5,40.58 29.5,37.58 29,37.08 28.61,37.08 U_AS_1.5 27.5,35.97 27.5,33.08 26.55,32.13 R_SHUNT_1.2 25.95,32.08 v24.5,32.08
  Bottom 0.406: v18.5,33.58 21.5,33.58 23,32.08 v24.5,32.08
VIN  (via drill 0.6)
  Top 0.813: v15.5,7.58 13.46,7.58 SW_PW.1
  Bottom 0.813: D3.A D2.A v15.5,7.58

### Text on the board
t_Silk: R_POT_1 | www.autofabricantes.org / CC BY-SA 2.0 | C_AS_1 | C_DR_1 | U_DR_1 | U_AS_1 | MYO_ESPControlBoard_Rev_1 | R_SHUNT_1 | R_AS_1 | L_RGB_0 | Q_JTAG_0 | R_AXL_SDA | R_TX | U_AXL | U_ESP | R_AXL_SCL | R_JTAG_0 | R_AXL_0 | R_ESP2 | R_JTAG_1 | Q_JTAG_1 | U_DR_0 | R_SHUNT_0 | C_AS_0 | R_SW_0 | R_AS_0 | C_DR_0 | SW_00 | U_AS_0 | R_POT_0
b_Silk: R_PW | R_ESP_0 | LED_PW | C_ESP_1 | C_ESP_2 | C_ESP_3 | R_ESP_4 | U_VR_0 | U_VR_1 | C_VR_3 | SW_PW | J_PW | C_VR_2 | D2 | D3